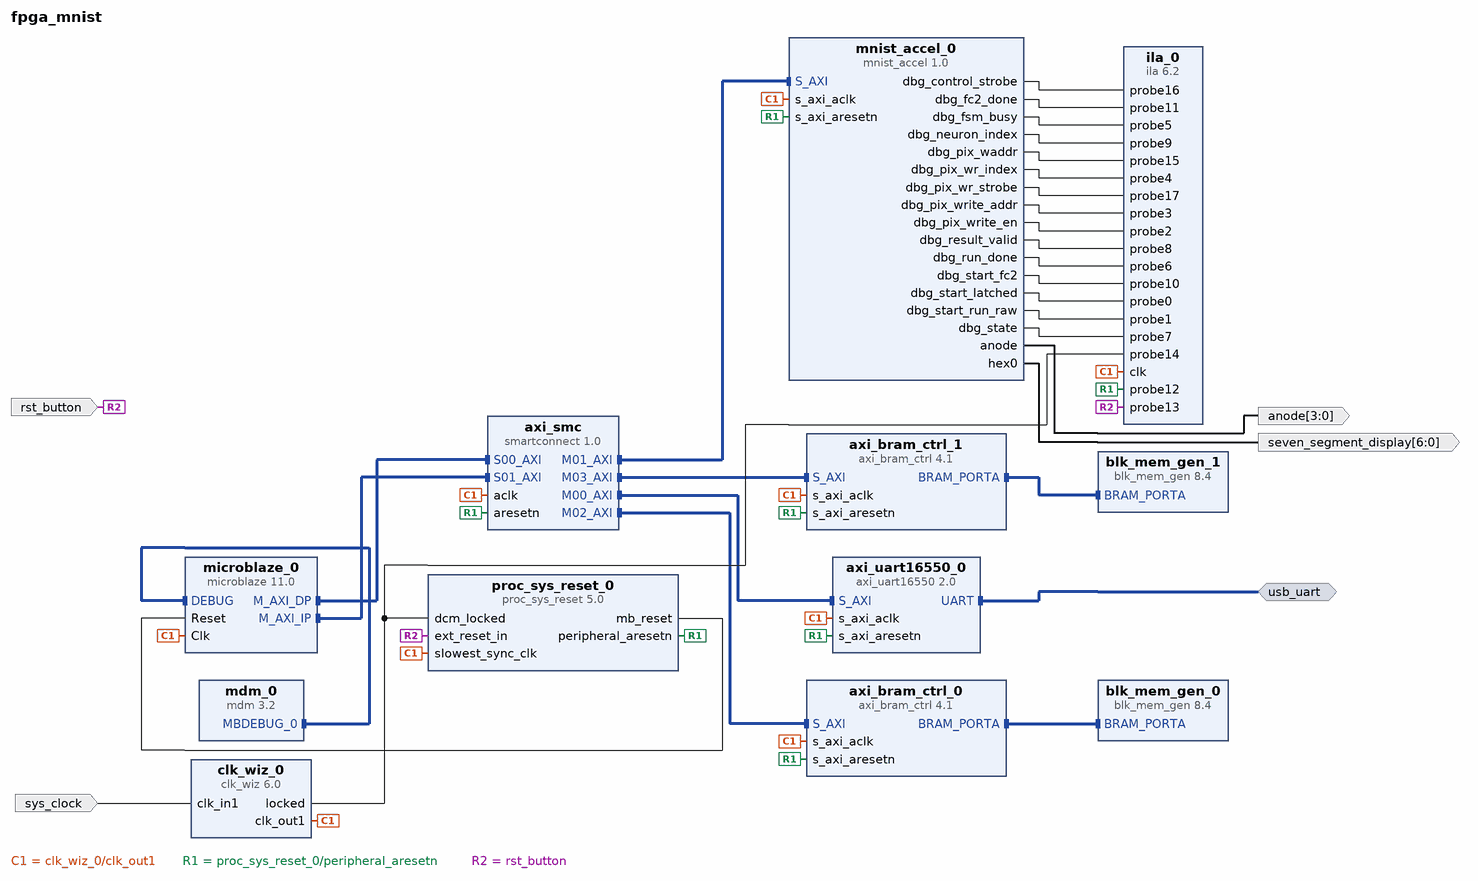
[diagram p0: block diagram of the top level]
# Vivado block design fpga_mnist, xc7a35tcpg236-1, Vivado 2024.2
create_bd_design fpga_mnist

create_bd_intf_port -mode Master -vlnv xilinx.com:interface:uart_rtl:1.0 usb_uart
create_bd_port -dir O -from 6 -to 0 seven_segment_display
create_bd_port -dir I -type clk sys_clock
set_property -dict {CONFIG.FREQ_HZ 100000000} [get_bd_ports sys_clock]
create_bd_port -dir I -type rst rst_button
set_property -dict {CONFIG.POLARITY ACTIVE_HIGH} [get_bd_ports rst_button]
create_bd_port -dir O -from 3 -to 0 anode

create_bd_cell -type ip -vlnv xilinx.com:ip:microblaze:11.0 microblaze_0
set_property -dict [list \
  CONFIG.C_DEBUG_ENABLED 1 \
  CONFIG.C_D_AXI 1 \
  CONFIG.C_D_LMB 0 \
  CONFIG.C_ENABLE_CONVERSION 0 \
  CONFIG.C_I_AXI 1 \
  CONFIG.C_I_LMB 0 \
  CONFIG.C_USE_DCACHE 0 \
  CONFIG.C_USE_ICACHE 0 \
  CONFIG.C_USE_MMU 0 \
] [get_bd_cells microblaze_0]
create_bd_cell -type ip -vlnv xilinx.com:ip:clk_wiz:6.0 clk_wiz_0
set_property -dict {CONFIG.RESET_BOARD_INTERFACE reset CONFIG.USE_BOARD_FLOW true} [get_bd_cells clk_wiz_0]
create_bd_cell -type ip -vlnv xilinx.com:ip:proc_sys_reset:5.0 proc_sys_reset_0
create_bd_cell -type ip -vlnv xilinx.com:ip:smartconnect:1.0 axi_smc
set_property -dict {CONFIG.NUM_MI 4 CONFIG.NUM_SI 2} [get_bd_cells axi_smc]
create_bd_cell -type ip -vlnv xilinx.com:ip:blk_mem_gen:8.4 blk_mem_gen_1
set_property -dict {CONFIG.use_bram_block BRAM_Controller} [get_bd_cells blk_mem_gen_1]
create_bd_cell -type ip -vlnv xilinx.com:ip:mdm:3.2 mdm_0
create_bd_cell -type ip -vlnv xilinx.com:ip:axi_bram_ctrl:4.1 axi_bram_ctrl_0
set_property -dict {CONFIG.PROTOCOL AXI4 CONFIG.SINGLE_PORT_BRAM 1} [get_bd_cells axi_bram_ctrl_0]
create_bd_cell -type ip -vlnv xilinx.com:ip:blk_mem_gen:8.4 blk_mem_gen_0
create_bd_cell -type ip -vlnv xilinx.com:ip:axi_bram_ctrl:4.1 axi_bram_ctrl_1
set_property -dict {CONFIG.SINGLE_PORT_BRAM 1} [get_bd_cells axi_bram_ctrl_1]
create_bd_cell -type ip -vlnv xilinx.com:ip:ila:6.2 ila_0
set_property -dict [list \
  CONFIG.C_MONITOR_TYPE Native \
  CONFIG.C_NUM_OF_PROBES 18 \
  CONFIG.C_PROBE15_WIDTH 8 \
  CONFIG.C_PROBE3_WIDTH 8 \
  CONFIG.C_PROBE4_WIDTH 8 \
  CONFIG.C_PROBE7_WIDTH 3 \
  CONFIG.C_PROBE8_WIDTH 32 \
  CONFIG.C_PROBE9_WIDTH 16 \
] [get_bd_cells ila_0]
create_bd_cell -type ip -vlnv xilinx.com:user:mnist_accel:1.0 mnist_accel_0
create_bd_cell -type ip -vlnv xilinx.com:ip:axi_uart16550:2.0 axi_uart16550_0
set_property -dict [list \
  CONFIG.C_HAS_EXTERNAL_XIN 0 \
  CONFIG.UART_BOARD_INTERFACE usb_uart \
  CONFIG.USE_BOARD_FLOW true \
] [get_bd_cells axi_uart16550_0]

# ---- connections ----

connect_bd_intf_net [get_bd_intf_pins blk_mem_gen_0/BRAM_PORTA] [get_bd_intf_pins axi_bram_ctrl_0/BRAM_PORTA]
connect_bd_intf_net [get_bd_intf_pins axi_bram_ctrl_1/BRAM_PORTA] [get_bd_intf_pins blk_mem_gen_1/BRAM_PORTA]
connect_bd_intf_net [get_bd_intf_pins axi_smc/M00_AXI] [get_bd_intf_pins axi_uart16550_0/S_AXI]
connect_bd_intf_net [get_bd_intf_pins mnist_accel_0/S_AXI] [get_bd_intf_pins axi_smc/M01_AXI]
connect_bd_intf_net [get_bd_intf_pins axi_smc/M02_AXI] [get_bd_intf_pins axi_bram_ctrl_0/S_AXI]
connect_bd_intf_net [get_bd_intf_pins axi_smc/M03_AXI] [get_bd_intf_pins axi_bram_ctrl_1/S_AXI]
connect_bd_intf_net [get_bd_intf_ports usb_uart] [get_bd_intf_pins axi_uart16550_0/UART]
connect_bd_intf_net [get_bd_intf_pins microblaze_0/DEBUG] [get_bd_intf_pins mdm_0/MBDEBUG_0]
connect_bd_intf_net [get_bd_intf_pins microblaze_0/M_AXI_DP] [get_bd_intf_pins axi_smc/S00_AXI]
connect_bd_intf_net [get_bd_intf_pins microblaze_0/M_AXI_IP] [get_bd_intf_pins axi_smc/S01_AXI]
connect_bd_net [get_bd_pins clk_wiz_0/clk_out1] \
  [get_bd_pins microblaze_0/Clk] [get_bd_pins axi_smc/aclk] [get_bd_pins proc_sys_reset_0/slowest_sync_clk] \
  [get_bd_pins axi_bram_ctrl_0/s_axi_aclk] [get_bd_pins axi_bram_ctrl_1/s_axi_aclk] [get_bd_pins ila_0/clk] \
  [get_bd_pins axi_uart16550_0/s_axi_aclk] [get_bd_pins mnist_accel_0/s_axi_aclk]
connect_bd_net [get_bd_pins clk_wiz_0/locked] [get_bd_pins proc_sys_reset_0/dcm_locked] [get_bd_pins ila_0/probe14]
connect_bd_net [get_bd_pins mnist_accel_0/anode] [get_bd_ports anode]
connect_bd_net [get_bd_pins mnist_accel_0/dbg_control_strobe] [get_bd_pins ila_0/probe16]
connect_bd_net [get_bd_pins mnist_accel_0/dbg_fc2_done] [get_bd_pins ila_0/probe11]
connect_bd_net [get_bd_pins mnist_accel_0/dbg_fsm_busy] [get_bd_pins ila_0/probe5]
connect_bd_net [get_bd_pins mnist_accel_0/dbg_neuron_index] [get_bd_pins ila_0/probe9]
connect_bd_net [get_bd_pins mnist_accel_0/dbg_pix_waddr] [get_bd_pins ila_0/probe15]
connect_bd_net [get_bd_pins mnist_accel_0/dbg_pix_wr_index] [get_bd_pins ila_0/probe4]
connect_bd_net [get_bd_pins mnist_accel_0/dbg_pix_wr_strobe] [get_bd_pins ila_0/probe17]
connect_bd_net [get_bd_pins mnist_accel_0/dbg_pix_write_addr] [get_bd_pins ila_0/probe3]
connect_bd_net [get_bd_pins mnist_accel_0/dbg_pix_write_en] [get_bd_pins ila_0/probe2]
connect_bd_net [get_bd_pins mnist_accel_0/dbg_result_valid] [get_bd_pins ila_0/probe8]
connect_bd_net [get_bd_pins mnist_accel_0/dbg_run_done] [get_bd_pins ila_0/probe6]
connect_bd_net [get_bd_pins mnist_accel_0/dbg_start_fc2] [get_bd_pins ila_0/probe10]
connect_bd_net [get_bd_pins mnist_accel_0/dbg_start_latched] [get_bd_pins ila_0/probe0]
connect_bd_net [get_bd_pins mnist_accel_0/dbg_start_run_raw] [get_bd_pins ila_0/probe1]
connect_bd_net [get_bd_pins mnist_accel_0/dbg_state] [get_bd_pins ila_0/probe7]
connect_bd_net [get_bd_pins mnist_accel_0/hex0] [get_bd_ports seven_segment_display]
connect_bd_net [get_bd_pins proc_sys_reset_0/mb_reset] [get_bd_pins microblaze_0/Reset]
connect_bd_net [get_bd_pins proc_sys_reset_0/peripheral_aresetn] \
  [get_bd_pins axi_smc/aresetn] [get_bd_pins axi_bram_ctrl_0/s_axi_aresetn] [get_bd_pins axi_bram_ctrl_1/s_axi_aresetn] \
  [get_bd_pins ila_0/probe12] [get_bd_pins axi_uart16550_0/s_axi_aresetn] [get_bd_pins mnist_accel_0/s_axi_aresetn]
connect_bd_net [get_bd_ports rst_button] [get_bd_pins proc_sys_reset_0/ext_reset_in] [get_bd_pins ila_0/probe13]
connect_bd_net [get_bd_ports sys_clock] [get_bd_pins clk_wiz_0/clk_in1]
set_property HDL_ATTRIBUTE.BMM_INFO_PROCESSOR {microblaze-le > fpga_mnist axi_bram_ctrl_0 fpga_mnist axi_bram_ctrl_1} [get_bd_cells microblaze_0]
set_property HDL_ATTRIBUTE.KEEP_HIERARCHY yes [get_bd_cells microblaze_0]
set_property PFM.AXI_PORT {M_AXI_DC {memport "M_AXI_GP" sptag "" memory "" is_range "false"}} [get_bd_cells microblaze_0]
set_property PFM.CLOCK {clk_out1 {id "1" is_default "true" proc_sys_reset "/proc_sys_reset_0" status "fixed" freq_hz "100000000"}} [get_bd_cells clk_wiz_0]
set_property HDL_ATTRIBUTE.BMM_INFO_ADDRESS_SPACE {byte  0xC0000000 32 > fpga_mnist blk_mem_gen_0} [get_bd_cells axi_bram_ctrl_0]
set_property HDL_ATTRIBUTE.KEEP_HIERARCHY yes [get_bd_cells axi_bram_ctrl_0]
set_property HDL_ATTRIBUTE.BMM_INFO_ADDRESS_SPACE {byte  0xC2000000 32 > fpga_mnist blk_mem_gen_1} [get_bd_cells axi_bram_ctrl_1]
set_property HDL_ATTRIBUTE.KEEP_HIERARCHY yes [get_bd_cells axi_bram_ctrl_1]

# ---- address map ----
assign_bd_address -offset 0x44A00000 -range 64K -target_address_space [get_bd_addr_spaces microblaze_0/Data] [get_bd_addr_segs mnist_accel_0/S_AXI/S_AXI_reg]
assign_bd_address -offset 0x44A10000 -range 64K -target_address_space [get_bd_addr_spaces microblaze_0/Data] [get_bd_addr_segs axi_uart16550_0/S_AXI/Reg]
assign_bd_address -offset 0xC0000000 -range 8K -target_address_space [get_bd_addr_spaces microblaze_0/Data] [get_bd_addr_segs axi_bram_ctrl_0/S_AXI/Mem0]
assign_bd_address -offset 0xC2000000 -range 8K -target_address_space [get_bd_addr_spaces microblaze_0/Data] [get_bd_addr_segs axi_bram_ctrl_1/S_AXI/Mem0]
assign_bd_address -offset 0x44A00000 -range 64K -target_address_space [get_bd_addr_spaces microblaze_0/Instruction] [get_bd_addr_segs mnist_accel_0/S_AXI/S_AXI_reg]
assign_bd_address -offset 0x44A10000 -range 64K -target_address_space [get_bd_addr_spaces microblaze_0/Instruction] [get_bd_addr_segs axi_uart16550_0/S_AXI/Reg]
assign_bd_address -offset 0xC0000000 -range 8K -target_address_space [get_bd_addr_spaces microblaze_0/Instruction] [get_bd_addr_segs axi_bram_ctrl_0/S_AXI/Mem0]
assign_bd_address -offset 0xC2000000 -range 8K -target_address_space [get_bd_addr_spaces microblaze_0/Instruction] [get_bd_addr_segs axi_bram_ctrl_1/S_AXI/Mem0]

validate_bd_design
save_bd_design
